# EAGLE design power (EAGLE 5.11)
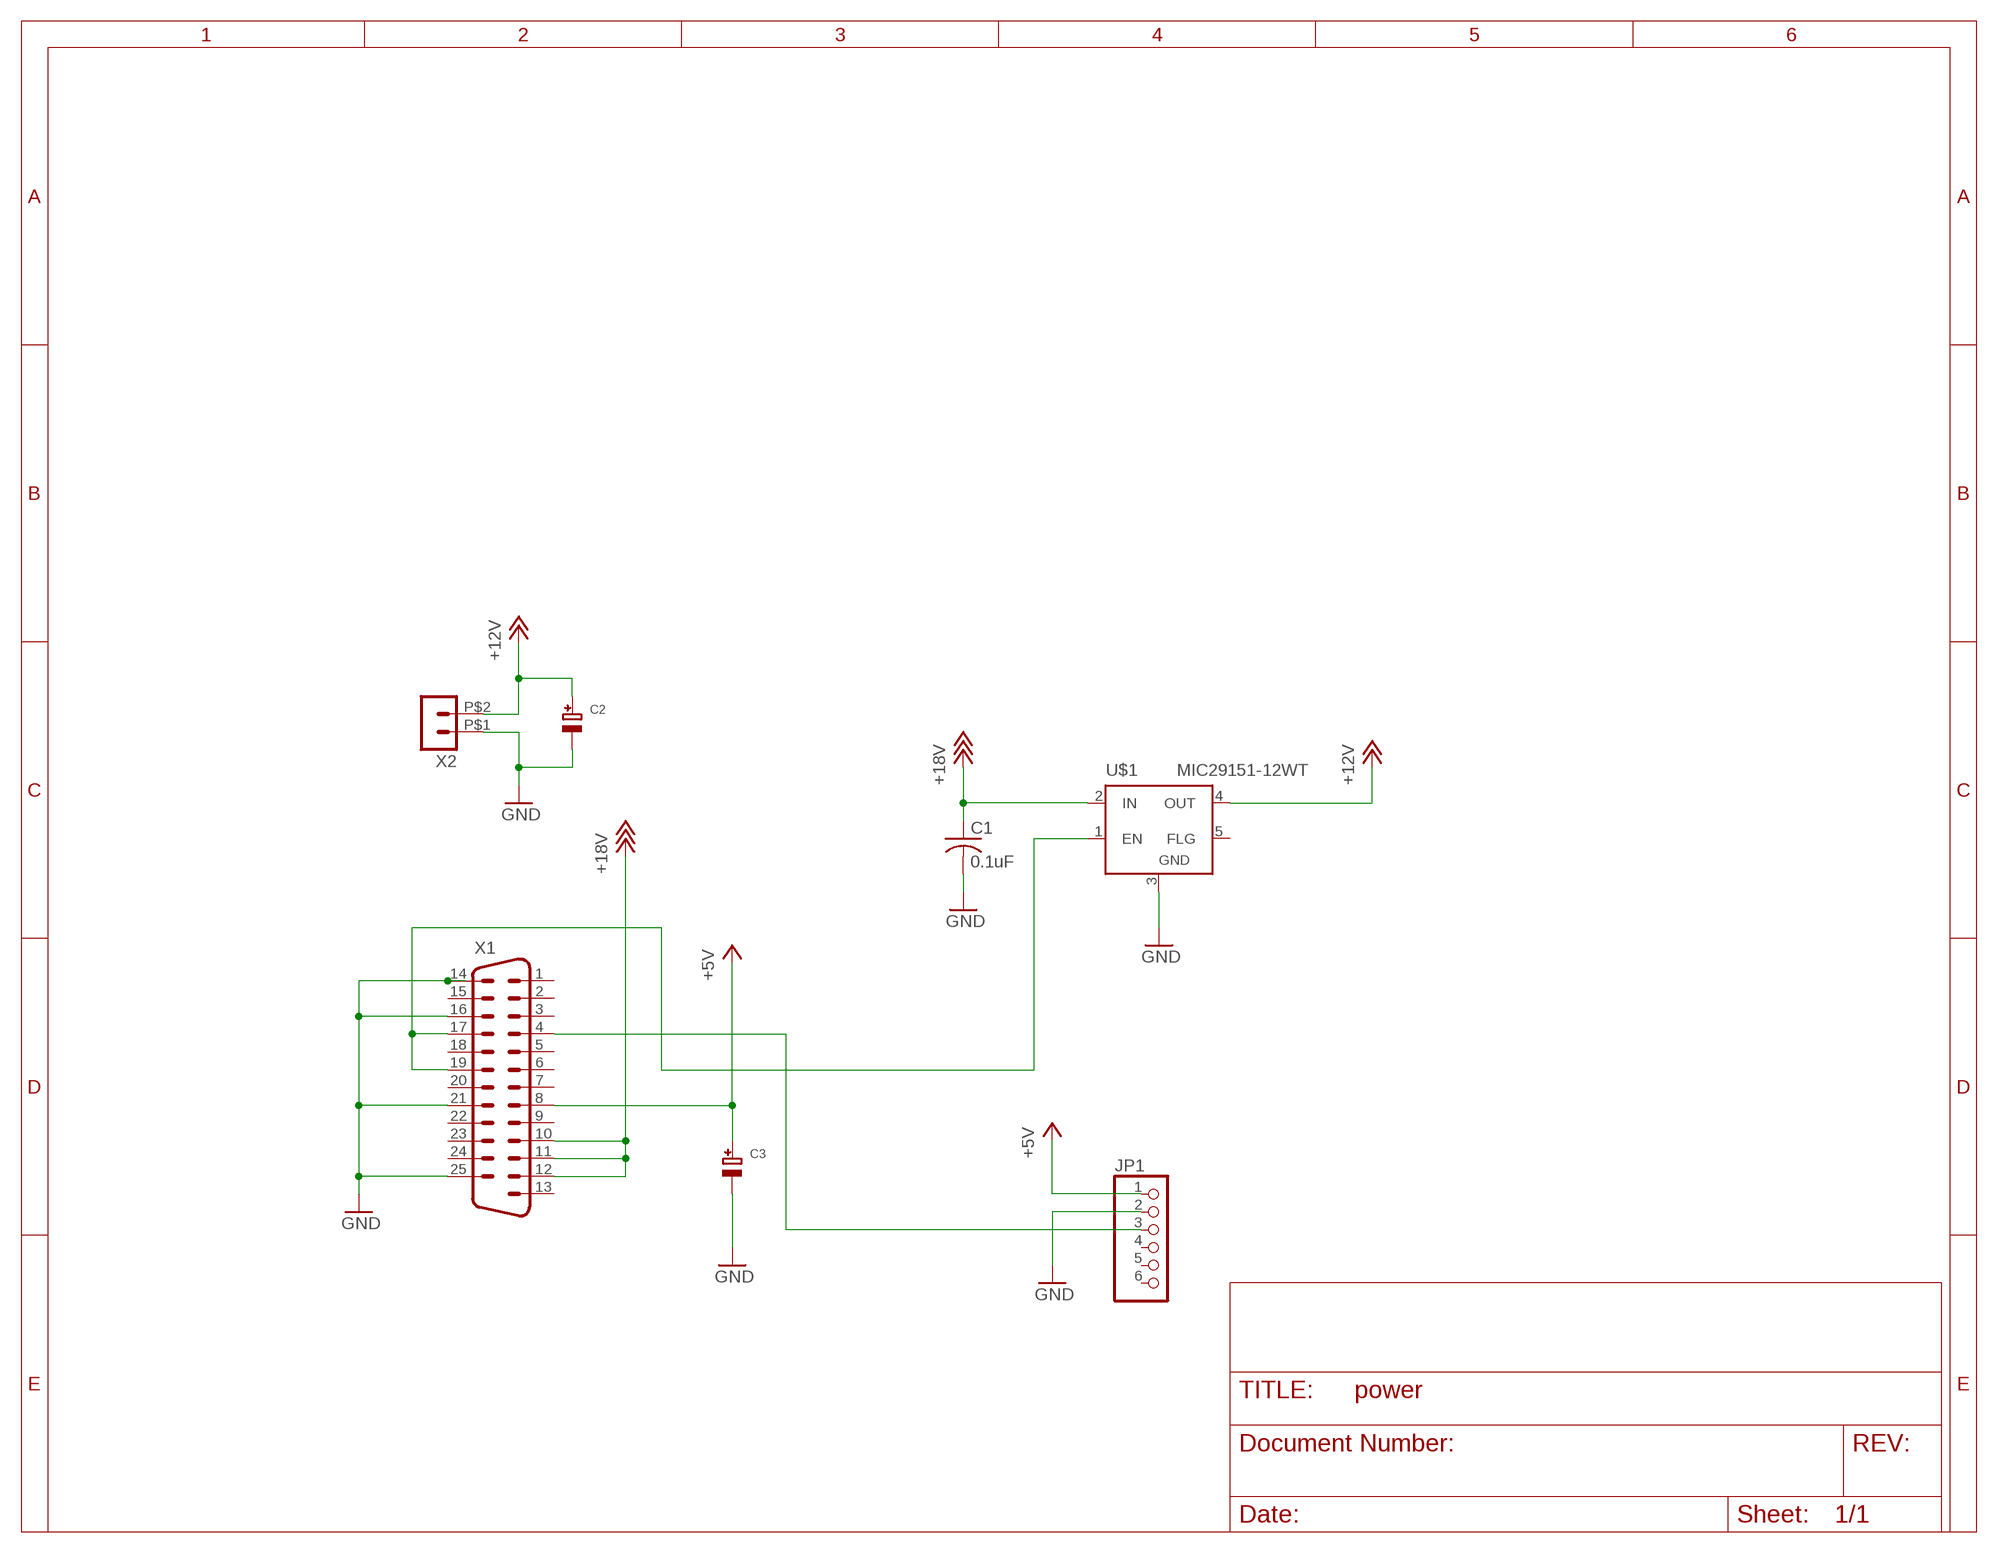
[diagram p0: schematic, sheet 1]

## Parts
C1  0.1uF  C-USC0805  [C0805]
C2  CAP_ELECTROLYTICPANASONIC_C  [PANASONIC_C]
C3  CAP_ELECTROLYTICPANASONIC_C  [PANASONIC_C]
JP1  PINHD-1X6  [1X06]
U$1  MIC29151-12WT  [TO-220-5]
X1  M25VP  [M25VP]
X2  HEADER_POS2_43045-0209  [43045-0209]

## Nets
+5V: C3.+ JP1.1 X1.8
+12V: C2.+ U$1.4(OUT) X2.P$2
+18V: C1.1 U$1.2(IN) X1.10 X1.11 X1.12
GND: C1.2 C2.- C3.- JP1.2 U$1.3(GND) X1.14 X1.16 X1.21 X1.25 X2.P$1
N$1: U$1.1(EN) X1.17 X1.19
N$4: JP1.3 X1.4
Unconnected: JP1.4 JP1.5 JP1.6 U$1.5(FLG) X1.1 X1.2 X1.3 X1.5 X1.6 X1.7 X1.9 X1.13 X1.15 X1.18 X1.20 X1.22 X1.23 X1.24

## Library data of the parts
C1 = rcl:C-US: CAPACITOR, American symbol
C2 C3 = microbuilder:CAP_ELECTROLYTIC: Electrolytic Capacitors PANASONIC_C - Size C Panasonic Electrolytic Aluminum Capacitor 47µF 16V 20% Electrolytic Capacitor [Digikey: PCE3890TR-ND] PANASONIC_D - Size D Panasonic Electrolytic Aluminum Capacitor 100µF 25V 20% Electrolytic Capacitor [Digikey: PCE3898TR-ND]
JP1 = pinhead:PINHD-1X6: PIN HEADER
U$1 = IHE:MIC29151-12WT
X1 = con-subd:M25: SUB-D; OC_FARNELL: unknown; OC_NEWARK: unknown
X2 = con-molex-micro-fit-3_0:HEADER_POS2_?: Molex - Micro-Fit 3.0 Series connector, 3.00mm (0.118") pitch header, 2 positions.

## Board
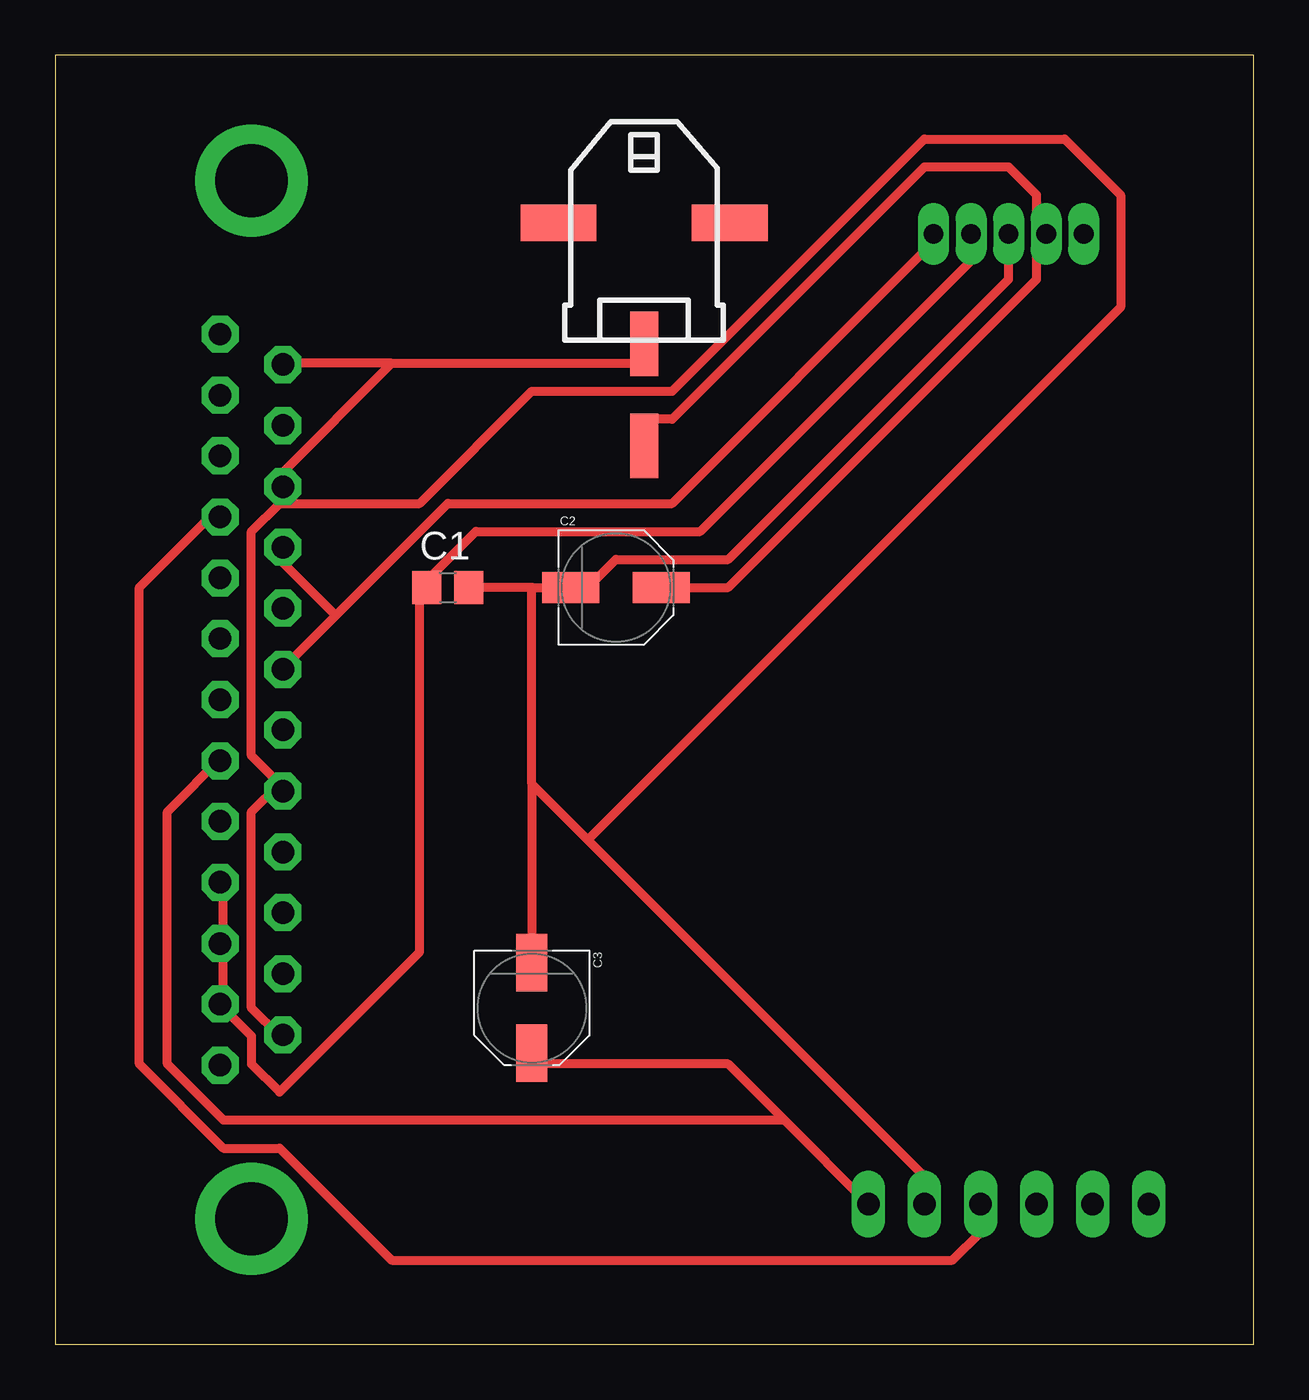
[diagram p1: board, top side]
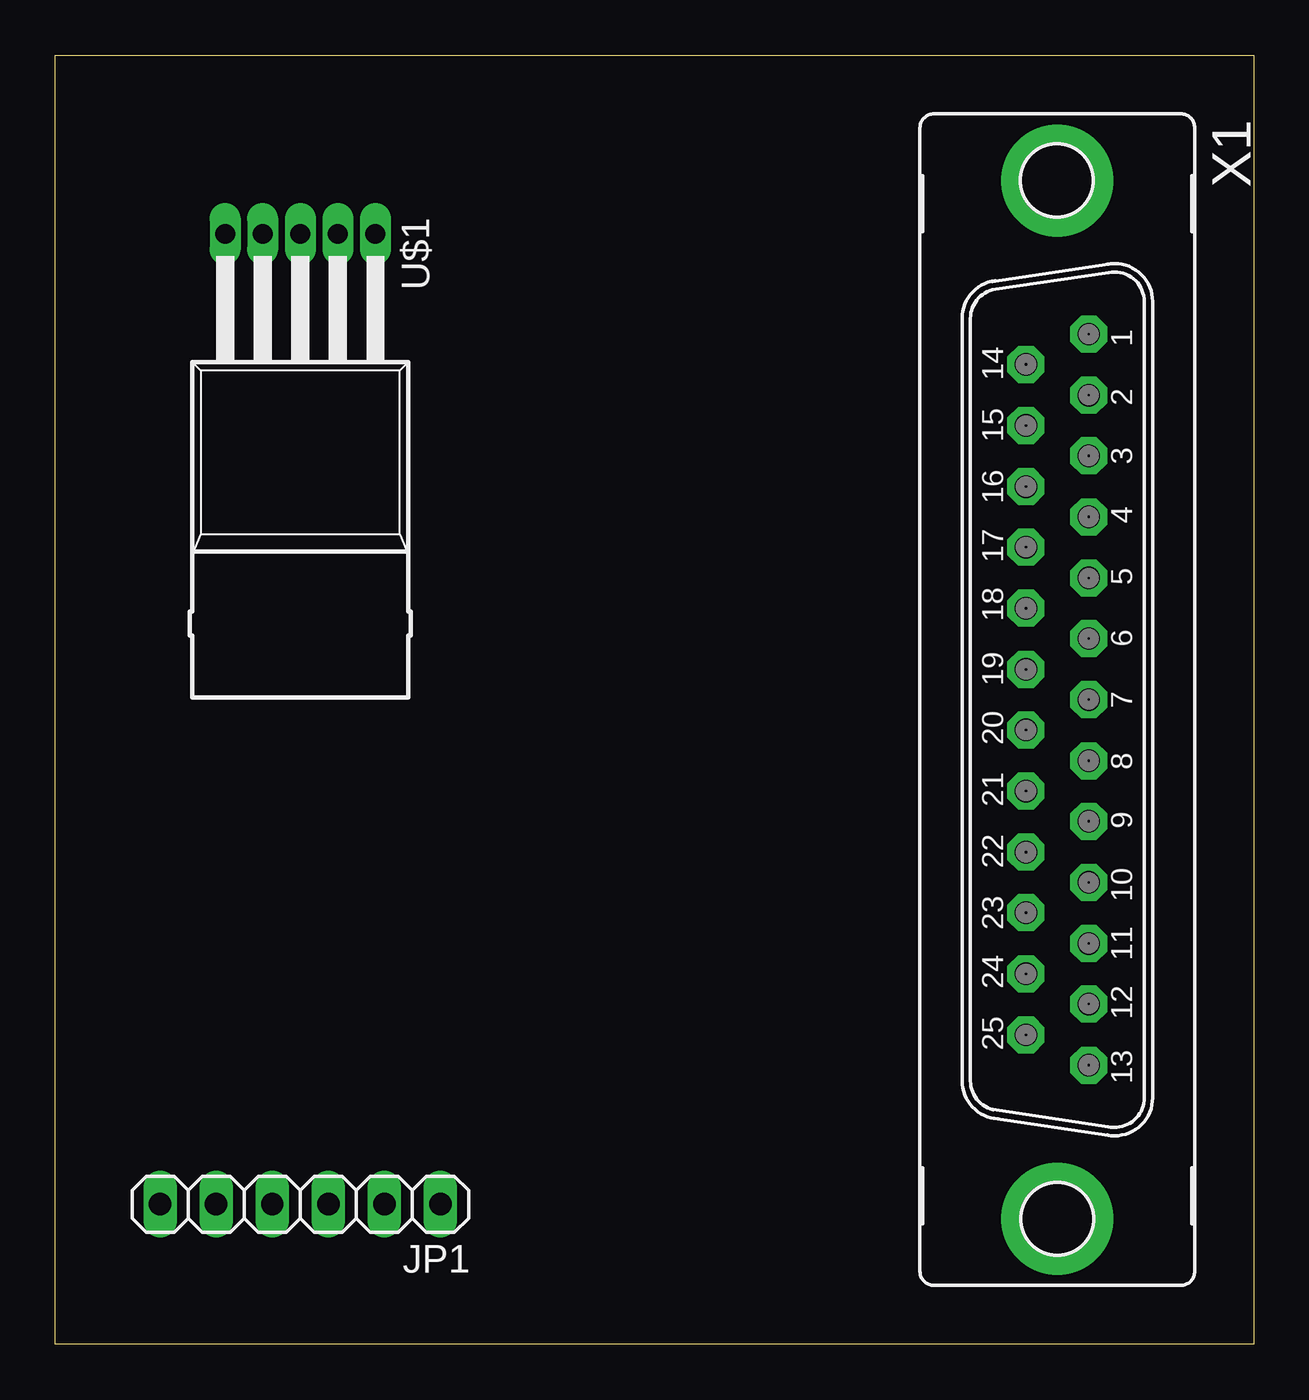
[diagram p2: board, bottom side, seen from below]

Size 54.28 x 58.41 mm. Coordinates in mm from the lower left corner, seen from the top.
Outline: 0,0 54.28,0 54.28,58.41 0,58.41 0,0
Copper layers (1*16): Top 0.035mm / dielectric 1.5mm / Bottom 0.035mm
Design rules "default *": minimum track width 16mil, minimum drill 24mil, track to track 14mil, track to pad 14mil, pad to pad 14mil, via to via 14mil, smd to smd 14mil, copper to edge 60mil, drill to drill 8mil, minimum pad ring 10mil, minimum via ring 10mil, stop-mask expansion 4mil, vias tented up to drill 0mil, thermal gap 10mil

### Footprints (pad centres in the part's own frame; a part is rotated, then mirrored left to right if it is on the bottom)
C0805 = smd 1.3 x 1.5: 1 -0.95,0; 2 0.95,0
PANASONIC_C = smd 2.6 x 1.4: + 2.05,0; - -2.05,0
1X06 = drill 1.016 long: 1 -6.35,0; 2 -3.81,0; 3 -1.27,0; 4 1.27,0; 5 3.81,0; 6 6.35,0
TO-220-5 = drill 0.9 long: 1 -3.4,-9.67; 2 -1.7,-9.67; 3 0,-9.67; 4 1.7,-9.67; 5 3.4,-9.67
M25VP = drill 1.016 pad 1.676 octagon: 1 -16.561,1.422; 2 -13.792,1.422; 3 -11.049,1.422; 4 -8.28,1.422; 5 -5.512,1.422; 6 -2.769,1.422; 7 0,1.422; 8 2.769,1.422; 9 5.512,1.422; 10 8.28,1.422; 11 11.049,1.422; 12 13.792,1.422; 13 16.561,1.422; 14 -15.189,-1.422; 15 -12.421,-1.422; 16 -9.652,-1.422; 17 -6.909,-1.422; 18 -4.14,-1.422; 19 -1.372,-1.422; 20 1.372,-1.422; 21 4.14,-1.422; 22 6.909,-1.422; 23 9.652,-1.422; 24 12.421,-1.422; 25 15.189,-1.422 | drill 3.302 pad 5.08 round: G1 -23.52,0; G2 23.52,0
43045-0209 = smd 1.27 x 2.92: P$1 0,5.47; P$2 0,10.1 | smd 3.43 x 1.65: TAB1 -3.88,0; TAB2 3.88,0

### Placement (x,y rotation side)
C1  17.78,34.29 0 top
C2  25.4,34.29 0 top
C3  21.59,15.24 270 top
JP1  43.18,6.35 180 bottom
U$1  43.18,40.64 180 bottom
X1  8.89,29.21 270 bottom
X2  26.67,50.8 180 top

### Tracks (layer width: path | path; a pad name or v marks a point on that pad's centre or on a via)
+5V
  Top 0.406: 33.02,10.16 JP1.1 | 33.02,10.16 30.48,12.7 21.59,12.7 C3.+ | 33.02,10.16 7.62,10.16 5.08,12.7 5.08,24.13 7.62,26.67 X1.8
+12V
  Top 0.406: C2.+ 30.48,34.29 44.45,48.26 44.45,49.53 U$1.4 44.45,50.8 44.45,52.07 43.18,53.34 39.37,53.34 27.94,41.91 26.67,41.91 X2.P$2
+18V
  Top 0.406: 7.62,15.24 7.62,17.78 | 7.62,17.78 7.62,20.32 X1.10 | 7.62,17.78 X1.11 | 16.51,34.29 19.05,36.83 29.21,36.83 41.91,49.53 U$1.2 | 7.62,15.24 8.89,13.97 8.89,12.7 10.16,11.43 16.51,17.78 16.51,34.29 | X1.12 7.62,15.24 | 16.51,34.29 C1.1
GND
  Top 0.406: 10.16,25.4 8.89,24.13 8.89,15.24 10.16,13.97 X1.25 | 15.24,44.45 10.16,44.45 X1.14 | 15.24,44.45 26.67,44.45 X2.P$1 | 15.24,44.45 10.16,39.37 X1.16 10.16,38.1 | 10.16,25.4 8.89,26.67 8.89,36.83 10.16,38.1 | 10.16,25.4 X1.21 | 21.59,34.29 C1.2 | 21.59,34.29 C2.- 24.13,34.29 25.4,35.56 30.48,35.56 43.18,48.26 U$1.3 | 21.59,25.4 21.59,34.29 | 21.59,25.4 C3.- | JP1.2 39.37,7.62 24.13,22.86 | 24.13,22.86 21.59,25.4 | 10.16,38.1 16.51,38.1 21.59,43.18 27.94,43.18 39.37,54.61 45.72,54.61 48.26,52.07 48.26,46.99 24.13,22.86
N$1
  Top 0.406: 12.7,33.02 10.16,30.48 X1.19 | 12.7,33.02 17.78,38.1 27.94,38.1 39.37,49.53 U$1.1 | 12.7,33.02 10.16,35.56 X1.17
N$4
  Top 0.406: JP1.3 41.91,5.08 40.64,3.81 15.24,3.81 10.16,8.89 7.62,8.89 3.81,12.7 3.81,34.29 7.62,38.1 X1.4